# Altium schematic sheet CAMERA.schdoc
size 489 x 171 mm
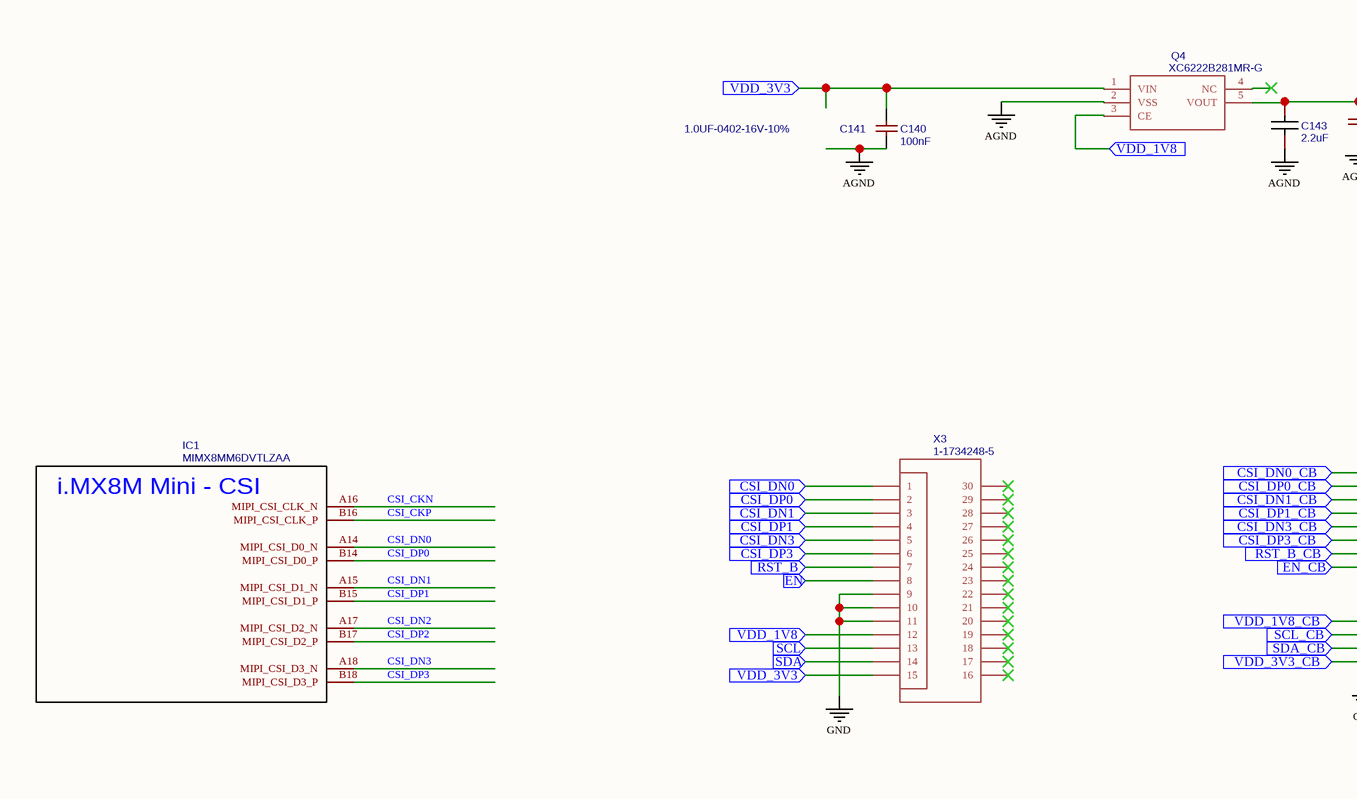
[diagram p0: CAMERA.schdoc, left]
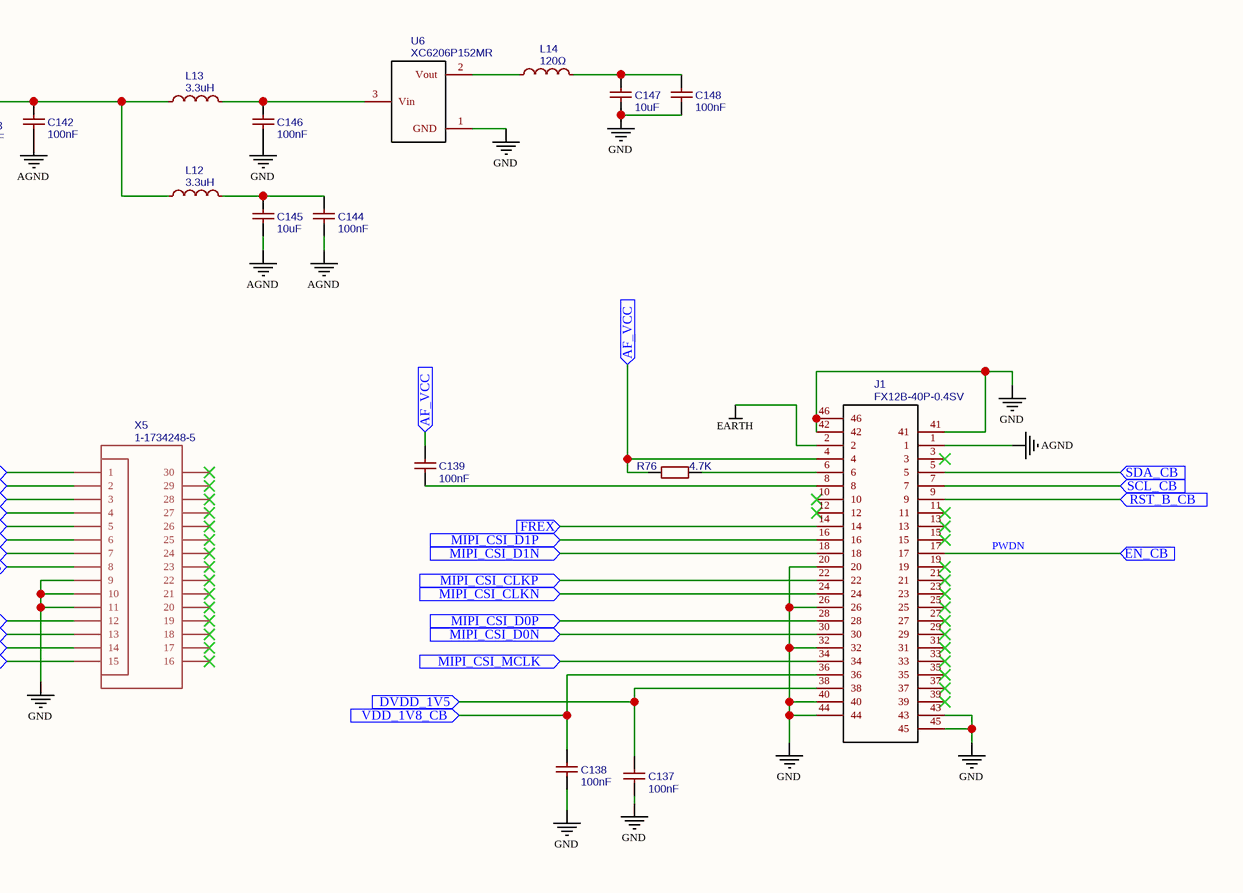
[diagram p1: CAMERA.schdoc, right]

## Parts
C137  100nF  [C0402]
C138  100nF  [C0402]
C139  100nF  [C0402]
C140  100nF  [C0402]
C141  1.0UF-0402-16V-10%  [0402]
C142  100nF  [C0402]
C143  2.2uF  [C0402]
C144  100nF  [C0402]
C145  10uF  [C0805]
C146  100nF  [C0402]
C147  10uF  [C0805]
C148  100nF  [C0402]
IC1  MIMX8MM6DVTLZAA  [BGA486C50P27X27_1400X1400X125]
J1  FX12B-40P-0.4SV  [FX12B40P04SV]
L12  3.3uH  [L0402]
L13  3.3uH  [L0402]
L14  120Ω  [L0402]
Q4  XC6222B281MR-G  [SOT95P280X130-5N]
R76  4.7K  [R0402]
U6  XC6206P152MR  [SOT-23-3_L2.9-W1.6-P1.90-LS2.8-BR]
X3  1-1734248-5  [1-1734248-5]
X5  1-1734248-5  [1-1734248-5]

## Ports
AF_VCC (in), CSI_DN0 (in), CSI_DN0_CB (in), CSI_DN1 (in), CSI_DN1_CB (in), CSI_DN3 (in), CSI_DN3_CB (in), CSI_DP0 (in), CSI_DP0_CB (in), CSI_DP1 (in), CSI_DP1_CB (in), CSI_DP3 (in), CSI_DP3_CB (in), DVDD_1V5 (in), EN (in), EN_CB (in), FREX (in), MIPI_CSI_CLKN (in), MIPI_CSI_CLKP (in), MIPI_CSI_D0N (in), MIPI_CSI_D0P (in), MIPI_CSI_D1N (in), MIPI_CSI_D1P (in), MIPI_CSI_MCLK (in), RST_B (in), RST_B_CB (in), SCL (in), SCL_CB (in), SDA (in), SDA_CB (in), VDD_1V8 (in), VDD_1V8_CB (in), VDD_3V3 (in), VDD_3V3_CB (in)

## Nets
AGND: C140.1 C142.1 C143.1 C144.1 C145.1 J1.1 Q4.2(VSS)
EARTH: J1.2
GND: C137.1 C138.1 C146.1 C147.1 C148.1 J1.20 J1.26 J1.32 J1.40 J1.41 J1.42 J1.43 J1.44 J1.45 J1.46 U6.1(GND) X3.9 X3.10 X3.11 X5.9 X5.10 X5.11
AF_VCC: C139.2 J1.4 R76.1 ; port AF_VCC
CSI_CKN: IC1.A16(MIPI_CSI_CLK_N)
CSI_CKP: IC1.B16(MIPI_CSI_CLK_P)
CSI_DN0: IC1.A14(MIPI_CSI_D0_N)
CSI_DN0: X3.1 ; port CSI_DN0  [a separate net that carries the same name]
CSI_DN0_CB: X5.1 ; port CSI_DN0_CB
CSI_DN1: IC1.A15(MIPI_CSI_D1_N)
CSI_DN1: X3.3 ; port CSI_DN1  [a separate net that carries the same name]
CSI_DN1_CB: X5.3 ; port CSI_DN1_CB
CSI_DN2: IC1.A17(MIPI_CSI_D2_N)
CSI_DN3: IC1.A18(MIPI_CSI_D3_N)
CSI_DN3: X3.5 ; port CSI_DN3  [a separate net that carries the same name]
CSI_DN3_CB: X5.5 ; port CSI_DN3_CB
CSI_DP0: IC1.B14(MIPI_CSI_D0_P)
CSI_DP0: X3.2 ; port CSI_DP0  [a separate net that carries the same name]
CSI_DP0_CB: X5.2 ; port CSI_DP0_CB
CSI_DP1: IC1.B15(MIPI_CSI_D1_P)
CSI_DP1: X3.4 ; port CSI_DP1  [a separate net that carries the same name]
CSI_DP1_CB: X5.4 ; port CSI_DP1_CB
CSI_DP2: IC1.B17(MIPI_CSI_D2_P)
CSI_DP3: IC1.B18(MIPI_CSI_D3_P)
CSI_DP3: X3.6 ; port CSI_DP3  [a separate net that carries the same name]
CSI_DP3_CB: X5.6 ; port CSI_DP3_CB
DVDD_1V5: C137.2 J1.38 ; port DVDD_1V5
EN: X3.8 ; port EN
FREX: J1.14 ; port FREX
MIPI_CSI_CLKN: J1.24 ; port MIPI_CSI_CLKN
MIPI_CSI_CLKP: J1.22 ; port MIPI_CSI_CLKP
MIPI_CSI_D0N: J1.30 ; port MIPI_CSI_D0N
MIPI_CSI_D0P: J1.28 ; port MIPI_CSI_D0P
MIPI_CSI_D1N: J1.18 ; port MIPI_CSI_D1N
MIPI_CSI_D1P: J1.16 ; port MIPI_CSI_D1P
MIPI_CSI_MCLK: J1.34 ; port MIPI_CSI_MCLK
PWDN: J1.17 X5.8 ; port EN_CB
RST_B: X3.7 ; port RST_B
RST_B_CB: J1.9 X5.7 ; port RST_B_CB
SCL: X3.13 ; port SCL
SCL_CB: J1.7 X5.13 ; port SCL_CB
SDA: X3.14 ; port SDA
SDA_CB: J1.5 X5.14 ; port SDA_CB
VDD_1V8: Q4.3(CE) X3.12 ; port VDD_1V8
VDD_1V8_CB: C138.2 J1.36 X5.12 ; port VDD_1V8_CB
VDD_3V3: C140.2 Q4.1(VIN) X3.15 ; port VDD_3V3
VDD_3V3_CB: X5.15 ; port VDD_3V3_CB
NetC139_1: C139.1 J1.8
NetC142_2: C142.2 C143.2 L12.1 L13.1 Q4.5(VOUT)
NetC144_2: C144.2 C145.2 L12.2
NetC146_2: C146.2 L13.2 U6.3(Vin)
NetC147_2: C147.2 C148.2 L14.2
NetJ1_6: J1.6 R76.2
NetL14_1: L14.1 U6.2(Vout)

Not connected (* = marked no-connect by the designer): J1 3* 10* 11* 12* 13* 15* 19* 21* 23* 25* 27* 29* 31* 33* 35* 37* 39*; Q4 4(NC)*; X3 16* 17* 18* 19* 20* 21* 22* 23* 24* 25* 26* 27* 28* 29* 30*; X5 16* 17* 18* 19* 20* 21* 22* 23* 24* 25* 26* 27* 28* 29* 30*

## Notes on the sheet
- (in symbol MIMX8MM6DVTLZAA) i.MX8M Mini - CSI

## Library data of the parts
C137-C140 C142 C144 C146 C148 = 100nF: BOM_Manufacturer Part: CL05B104KO5NNNC; BOM_Manufacturer: SAMSUNG; nameAlias: Capacitance; SMT Type: Basic; BOM_Supplier: LCSC; BOM_Supplier Part: C1525; BOM_JLCPCB SMD: Yes; spicePre: C; spiceSymbolName: CL05B104KO5NNNC
C141 = 1.0UF-0402-16V-10%: Contributor: Victor De la Torre; spicePre: C; spiceSymbolName: 1.0UF-0402-16V-10%
C143 = 2.2uF: BOM_Manufacturer Part: CL05A225MQ5NSNC; BOM_Manufacturer: SAMSUNG; nameAlias: Capacitance; SMT Type: Extend; BOM_Supplier: LCSC; BOM_Supplier Part: C12530; BOM_JLCPCB SMD: Yes; spicePre: C; spiceSymbolName: CL05A225MQ5NSNC
C145 C147 = 10uF: BOM_Manufacturer Part: CL21A106KAYNNNE; BOM_Manufacturer: SAMSUNG; nameAlias: Capacitance; SMT Type: Basic; BOM_Supplier: LCSC; BOM_Supplier Part: C15850; BOM_JLCPCB SMD: Yes; spicePre: C; spiceSymbolName: CL21A106KAYNNNE
IC1 = MIMX8MM6DVTLZAA: subpart_no: 2; Contributor: Ke'Ondrae_Mell; spicePre: I; spiceSymbolName: MIMX8MM6DVTLZAA
J1 = FX12B-40P-0.4SV: Contributor: Ke'Ondrae_Mell; spicePre: J; spiceSymbolName: FX12B-40P-0.4SV
L12 L13 = 3.3uH: BOM_Manufacturer Part: SDFL1005Q3R3KTF; BOM_Manufacturer: Sunlord; nameAlias: Inductance; SMT Type: Extend; BOM_Supplier: LCSC; BOM_Supplier Part: C84474; BOM_JLCPCB SMD: Yes; spicePre: L; spiceSymbolName: SDFL1005Q3R3KTF
L14 = 120Ω: BOM_Manufacturer: MuRata; BOM_Manufacturer Part: BLM15AG121SN1D; nameAlias: Value; SMT Type: Extend; BOM_Supplier: LCSC; BOM_Supplier Part: C85812; BOM_JLCPCB SMD: Yes; spicePre: L; spiceSymbolName: BLM15AG121SN1D
Q4 = XC6222B281MR-G: Contributor: Ke'Ondrae_Mell; spicePre: Q; spiceSymbolName: XC6222B281MR-G
R76 = 4.7K: BOM_Manufacturer: UniOhm; BOM_Manufacturer Part: 0402WGF4701TCE; nameAlias: Resistance (Ohms); SMT Type: Basic; BOM_Supplier: LCSC; BOM_Supplier Part: C25900; BOM_JLCPCB SMD: Yes; spicePre: R; spiceSymbolName: 0402WGF4701TCE
U6 = XC6206P152MR: BOM_Manufacturer: TOREX; SMT Type: Extend; BOM_Supplier: LCSC; BOM_Manufacturer Part: XC6206P152MR; image: //image.lceda.cn/szlcsc/C56110.jpg; BOM_Supplier Part: C56110; BOM_JLCPCB SMD: Yes; spicePre: U; spiceSymbolName: XC6206P152MR
X3 X5 = 1-1734248-5: Contributor: IBE_Acc; spicePre: X; spiceSymbolName: 1-1734248-5